# EAGLE design Platypus_FPC (EAGLE 7.6.0)
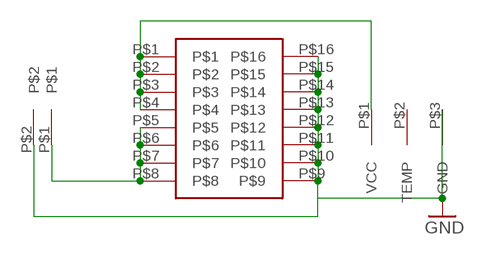
[diagram p0: schematic, sheet 1]

## Parts
U$1  BM10B(0.8)-16DP-0.4V(51)  [16-HEADER]
U$2  PLATY_BAT_PAD  [FPC-6]
U$3  PLATY_CHARGER_CON  [2-PAD]

## Nets
GND: U$1.P$9 U$1.P$10 U$1.P$11 U$1.P$12 U$1.P$13 U$1.P$14 U$1.P$15 U$1.P$16 U$2.P$3(GND) U$3.P$2
N$1: U$1.P$1 U$1.P$2 U$1.P$3 U$1.P$4 U$2.P$1(VCC)
N$2: U$1.P$5 U$1.P$6 U$1.P$7 U$1.P$8 U$3.P$1
Unconnected: U$2.P$2(TEMP)

## Library data of the parts
U$1 = Hirose_Bat_Head:BM10B(0.8)-16DP-0.4V(51)
U$2 = Platy_Bat_Pad:PLATY_BAT_PAD
U$3 = Platy_Charger_Con:PLATY_CHARGER_CON

## Board
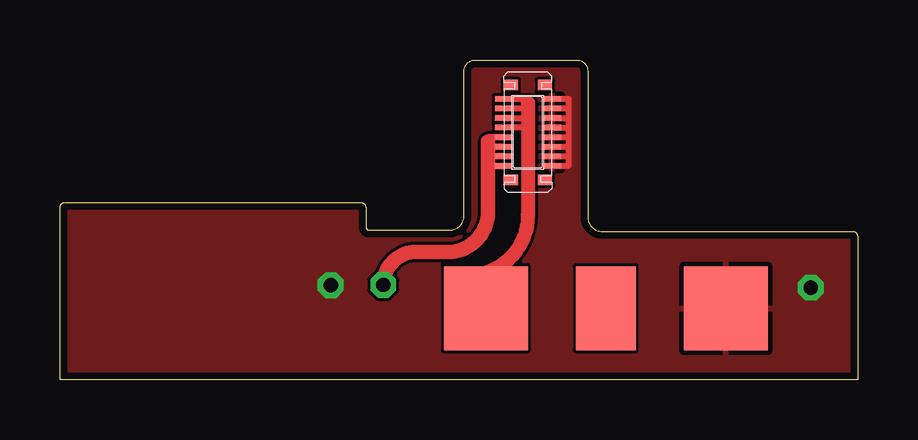
[diagram p1: board, top side]
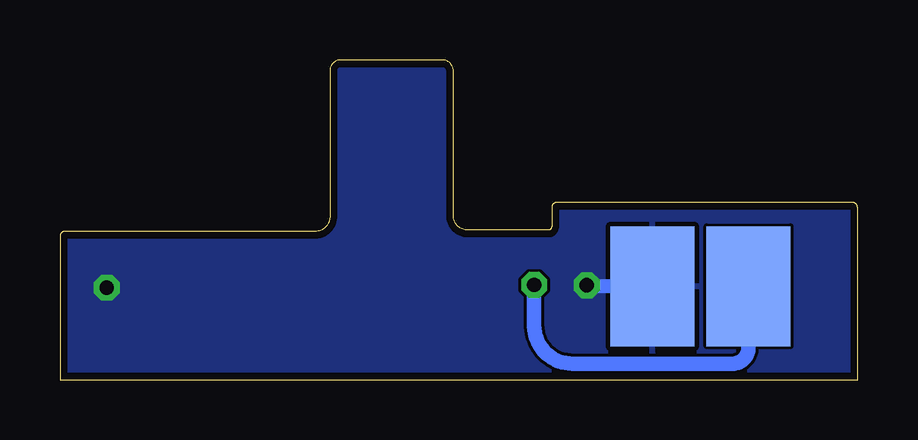
[diagram p2: board, bottom side, seen from below]

Size 33.25 x 13.35 mm. Coordinates in mm from the lower left corner, seen from the top.
Outline: 0,0 0,7.2 arc-90 0.2,7.4 12.55,7.4 arc-90 12.75,7.2 12.75,6.4 arc90 12.9,6.25 16.25,6.25 arc90 16.85,6.85 16.85,12.9 arc-90 17.3,13.35 21.55,13.35 arc-90 22,12.9 22,6.8 arc90 22.6,6.2 33.05,6.2 arc-90 33.25,6 33.25,0 0,0
Copper layers (1*16): Top 0.035mm / dielectric 1.5mm / Bottom 0.035mm
Design rules "PCB-POOL HighSpec": minimum track width 0.125mm, minimum drill 0.2mm, track to track 0.125mm, track to pad 0.125mm, pad to pad 0.125mm, via to via 0.125mm, smd to smd 0.125mm, copper to edge 0.3mm, drill to drill 0.2mm, minimum pad ring 0.2mm, minimum via ring 0.125mm, stop-mask expansion 0.075mm, vias tented up to drill 0mil, thermal gap 0.2mm

### Footprints (pad centres in the part's own frame; a part is rotated, then mirrored left to right if it is on the bottom)
16-HEADER = smd 0.23 x 0.74: P$1 0,0; P$2 0.4,0; P$3 0.8,0; P$4 1.2,0; P$5 1.6,0; P$6 2,0; P$7 2.4,0; P$8 2.8,0; P$9 2.8,2.02; P$10 2.4,2.02; P$11 2,2.02; P$12 1.6,2.02; P$13 1.2,2.02; P$14 0.8,2.02; P$15 0.4,2.02; P$16 0,2.02 | smd 0.44 x 0.59: P$17 -0.58,0.29; P$18 3.38,0.29; P$19 3.38,1.72; P$20 -0.57,1.72
FPC-6 = smd 3.5 x 3.5: P$1 0,0; P$3 10,0 | smd 2.5 x 3.5: P$2 5,0
2-PAD = smd 3.5 x 5 bottom: P$1 0,0; P$2 4,0

### Placement (x,y rotation side)
U$1  18.5,11.73 270 top
U$2  17.75,2.99 0 top
U$3  4.55,3.91 0 top

### Tracks (layer width: path | path; a pad name or v marks a point on that pad's centre or on a via)
GND  (via drill 0.6)
  Top 0.254: U$1.P$16 21.2,11.73 21.2,11.3 | 21.2,11.3 21.2,10.95 | 21.2,10.95 21.2,10.5 | 21.2,10.5 21.2,10.15 | 21.2,10.15 21.2,9.75 | 21.2,9.75 21.2,9.3 | 21.2,9.3 21.2,8.95 21.18,8.93 U$1.P$9 | U$1.P$15 21.17,11.33 arc-90 21.2,11.3 | U$1.P$14 21.18,10.93 arc90 21.2,10.95 | U$1.P$13 21.17,10.53 arc-90 21.2,10.5 | U$1.P$12 21.18,10.13 arc90 21.2,10.15 | U$1.P$11 21.18,9.73 arc90 21.2,9.75 | U$1.P$10 21.17,9.33 arc-90 21.2,9.3
  Top 0.6: U$2.P$3 27.75,4.35
  Bottom 0.6: U$3.P$2 11.31,3.92 arc-90 v11.29,3.95
  other vias: 31.3,3.85
  pour Top: 0,3.8 0,7.2 arc-90 0.2,7.4 12.55,7.4 arc-90 12.75,7.2 12.75,6.4 arc90 12.9,6.25 16.25,6.25 arc90 16.85,6.85 16.85,12.9 arc-90 17.3,13.35 21.55,13.35 arc-90 22,12.9 22,6.8 arc90 22.6,6.2 33.05,6.2 arc-90 33.25,6 33.25,0 0,0 0,3.75
  pour Bottom: 0,0.05 0,7.2 arc-90 0.2,7.4 12.55,7.4 arc-90 12.75,7.2 12.75,6.35 arc90 12.85,6.25 16.3,6.25 arc90 16.85,6.8 16.85,12.95 arc-90 17.25,13.35 21.55,13.35 arc-90 22,12.9 22,6.8 arc90 22.6,6.2 33.05,6.2 arc-90 33.25,6 33.25,0 0,0
N$1
  Top 0.254: 19.43,11.33 arc90 19.51,11.4 | 19.43,11.33 19.43,10.93 | 19.43,10.93 19.43,10.53 U$1.P$4 | U$1.P$1 19.5,11.73 19.5,11.55 | U$1.P$2 19.43,11.33 | U$1.P$3 19.43,10.93
  Top 0.59: 19.51,11.4 19.51,6.88 arc-90 16.97,4.34 16.97,3.77 arc90 U$2.P$1
  Top 0.6: 19.51,11.4 19.5,11.55
N$2  (via drill 0.6)
  Top 0.254: U$1.P$5 17.85,10.13 17.85,9.95 17.85,9.7 | 17.85,9.7 17.85,9.35 | 17.85,9.35 17.85,8.93 U$1.P$8 | U$1.P$6 17.88,9.73 arc90 17.85,9.7 | U$1.P$7 17.87,9.33 arc-90 17.85,9.35
  Top 0.6: 17.85,9.95 17.85,7.02 arc-90 16.17,5.34 14.85,5.34 arc90 v13.48,3.96
  Bottom 0.6: 4,2.45 4.35,3.38 | 4.35,3.38 U$3.P$1 | 4.35,3.38 arc-90 4.55,3.18 4.55,1.34 arc90 5.21,0.68 11.89,0.68 arc90 13.48,2.26 v13.48,3.96

### Text on the board
Stiffner: Stiffner | Stiffner